# EAGLE design licznik (EAGLE 6.6.0)
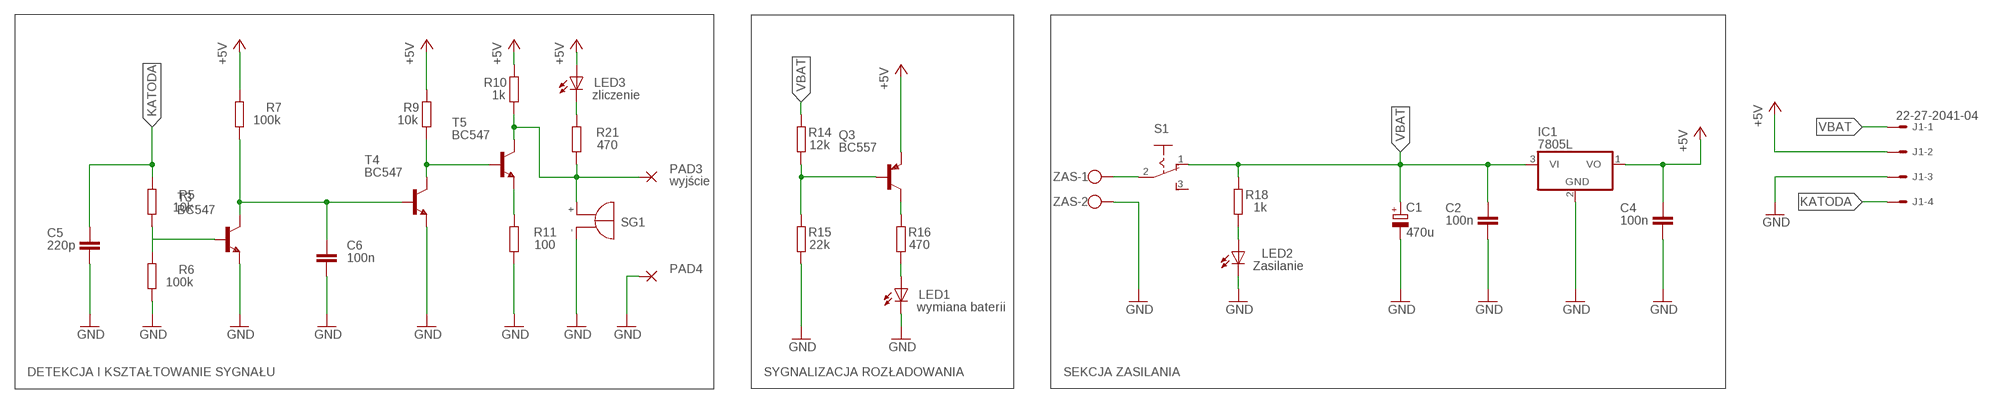
[diagram p0: schematic, sheet 1]

## Parts
C1  470u  CPOL-EUE3.5-8  [E3,5-8]
C2  100n  C5/3  [C5B3]
C4  100n  C5/3  [C5B3]
C5  220p  C5/3  [C5B3]
C6  100n  C5/3  [C5B3]
IC1  7805L  [TO92]
J1  22-27-2041-04  [6410-04]
LED1  wymiana baterii  LED3MM  [LED3MM]
LED2  Zasilanie  LED3MM  [LED3MM]
LED3  zliczenie  LED3MM  [LED3MM]
PAD3  wyjście  WIREPAD2,15/1,0  [2,15/1,0]
PAD4  WIREPAD2,15/1,0  [2,15/1,0]
Q3  BC557  [TO92]
R5  10k  R-EU_0207/10  [0207/10]
R6  100k  R-EU_0207/10  [0207/10]
R7  100k  R-EU_0207/10  [0207/10]
R9  10k  R-EU_0207/10  [0207/10]
R10  1k  R-EU_0207/10  [0207/10]
R11  100  R-EU_0207/10  [0207/10]
R14  12k  R-EU_0207/10  [0207/10]
R15  22k  R-EU_0207/10  [0207/10]
R16  470  R-EU_0207/10  [0207/10]
R18  1k  R-EU_0207/10  [0207/10]
R21  470  R-EU_0207/10  [0207/10]
S1  255SB  [255SB]
SG1  F/QMBIII  [F/QMBIII]
T3  BC547  [TO92]
T4  BC547  [TO92]
T5  BC547  [TO92]
ZAS  W237-102  [W237-102]

## Nets
+5V: C4.1 IC1.1(VO) J1.2 LED3.A Q3.1(E) R7.2 R9.2 R10.2
GND: C1.- C2.2 C4.2 C5.2 C6.2 IC1.2(GND) J1.3 LED1.K(C) LED2.K(C) PAD4.1(P) R6.1 R11.1 R15.1 SG1.-(+) T3.1(E) T4.1(E) ZAS.2
KATODA: C5.1 J1.4 R5.2
N$14: LED2.A R18.1
N$15: LED1.A R16.1
N$17: R5.1 R6.2 T3.2(B)
N$18: C6.1 R7.1 T3.3(C) T4.2(B)
N$19: R11.2 T5.1(E)
N$20: S1.2(P) ZAS.1
N$21: R9.1 T4.3(C) T5.2(B)
N$22: Q3.3(C) R16.2
N$23: Q3.2(B) R14.1 R15.2
N$24: LED3.K(C) R21.2
VBAT: C1.+ C2.1 IC1.3(VI) J1.1 R14.2 R18.2 S1.1(O)
WYJSCIE: PAD3.1(P) R10.1 R21.1 SG1.+(-) T5.3(C)
Unconnected: S1.3(S)

## Notes on the sheet
- DETEKCJA I KSZTAŁTOWANIE SYGNAŁU | SYGNALIZACJA ROZŁADOWANIA | SEKCJA ZASILANIA

## Library data of the parts
C1 = resistor:CPOL-EU: POLARIZED CAPACITOR, European symbol
C2 C4-C6 = capacitor-wima:C: CAPACITOR naming: grid - package width
IC1 = linear:78*: Positive VOLTAGE REGULATOR Source: http://cache.national.com/ds/LM/LM78L05.pdf http://www.fairchildsemi.com/ds/LM/LM7805.pdf
J1 = con-molex:22-?-04: CONNECTOR wire to board 2.54 mm (.1 inch) pitch header; OC_FARNELL: unknown; OC_NEWARK: unknown
LED1-LED3 = led:LED: LED OSRAM: - CHIPLED LG R971, LG N971, LY N971, LG Q971, LY Q971, LO R971, LY R971 LH N974, LH R974 LS Q976, LO Q976, LY Q976 LO Q996 - Hyper CHIPLED LW Q18S LB Q993, LB Q99A, LB R99A - SideLED LS A670, LO A670, LY A670, LG A670, LP A670 LB A673, LV A673, LT A673, LW A673 LH A674 LY A675 LS A676, LA A676, LO A676, LY A676, LW A676 LS A679, LY A679, LG A679 - Hyper Micro SIDELED® LS Y876, LA Y876, LO Y876, LY Y876 LT Y87S - SmartLED LW L88C, LW L88S LB L89C, LB L89S, LG L890 LS L89K, LO L89K, LY L89K LS L896, LA L896, LO L896, LY L896 - TOPLED LS T670, LO T670, LY T670, LG T670, LP T670 LSG T670, LSP T670, LSY T670, LOP T670, LYG T670 LG T671, LOG T671, LSG T671 LB T673, LV T673, LT T673, LW T673 LH T674 LS T676, LA T676, LO T676, LY T676, LB T676, LH T676, LSB T676, LW T676 LB T67C, LV T67C, LT T67C, LS T67K, LO T67K, LY T67K, LW E67C LS E67B, LA E67B, LO E67B, LY E67B, LB E67C, LV E67C, LT E67C LW T67C LS T679, LY T679, LG T679 LS T770, LO T770, LY T770, LG T770, LP T770 LB T773, LV T773, LT T773, LW T773 LH T774 LS E675, LA E675, LY E675, LS T675 LS T776, LA T776, LO T776, LY T776, LB T776 LHGB T686 LT T68C, LB T68C - Hyper Mini TOPLED® LB M676 - Mini TOPLED Santana® LG M470 LS M47K, LO M47K, LY M47K Source: http://www.osram.convergy.de LUXEON: - LUMILED® LXK2-PW12-R00, LXK2-PW12-S00, LXK2-PW14-U00, LXK2-PW14-V00 LXK2-PM12-R00, LXK2-PM12-S00, LXK2-PM14-U00 LXK2-PE12-Q00, LXK2-PE12-R00, LXK2-PE12-S00, LXK2-PE14-T00, LXK2-PE14-U00 LXK2-PB12-K00, LXK2-PB12-L00, LXK2-PB12-M00, LXK2-PB14-N00, LXK2-PB14-P00, LXK2-PB14-Q00 LXK2-PR12-L00, LXK2-PR12-M00, LXK2-PR14-Q00, LXK2-PR14-R00 LXK2-PD12-Q00, LXK2-PD12-R00, LXK2-PD12-S00 LXK2-PH12-R00, LXK2-PH12-S00 LXK2-PL12-P00, LXK2-PL12-Q00, LXK2-PL12-R00 Source: www.luxeon.com KINGBRIGHT: KA-3528ASYC Source: www.kingbright.com
PAD3 PAD4 = wirepad:WIREPAD: Wire PAD connect wire on PCB
Q3 = transistor-pnp:BC557: PNP Transistor
R5-R7 R9-R11 R14-R16 R18 R21 = resistor:R-EU_: RESISTOR, European symbol
S1 = switch:255SB: SLIDING SWITCH Distributor Buerklin, 11G810
SG1 = buzzer:F/QMBIII: BUZZER Source: Buerklin; OC_FARNELL: unknown; OC_NEWARK: unknown
T3-T5 = transistor:BC547: NPN TRANSISTOR
ZAS = con-wago-500:W237-102: WAGO SCREW CLAMP; MPN: 237-102; OC_FARNELL: unknown; OC_NEWARK: 70K9898

## Board
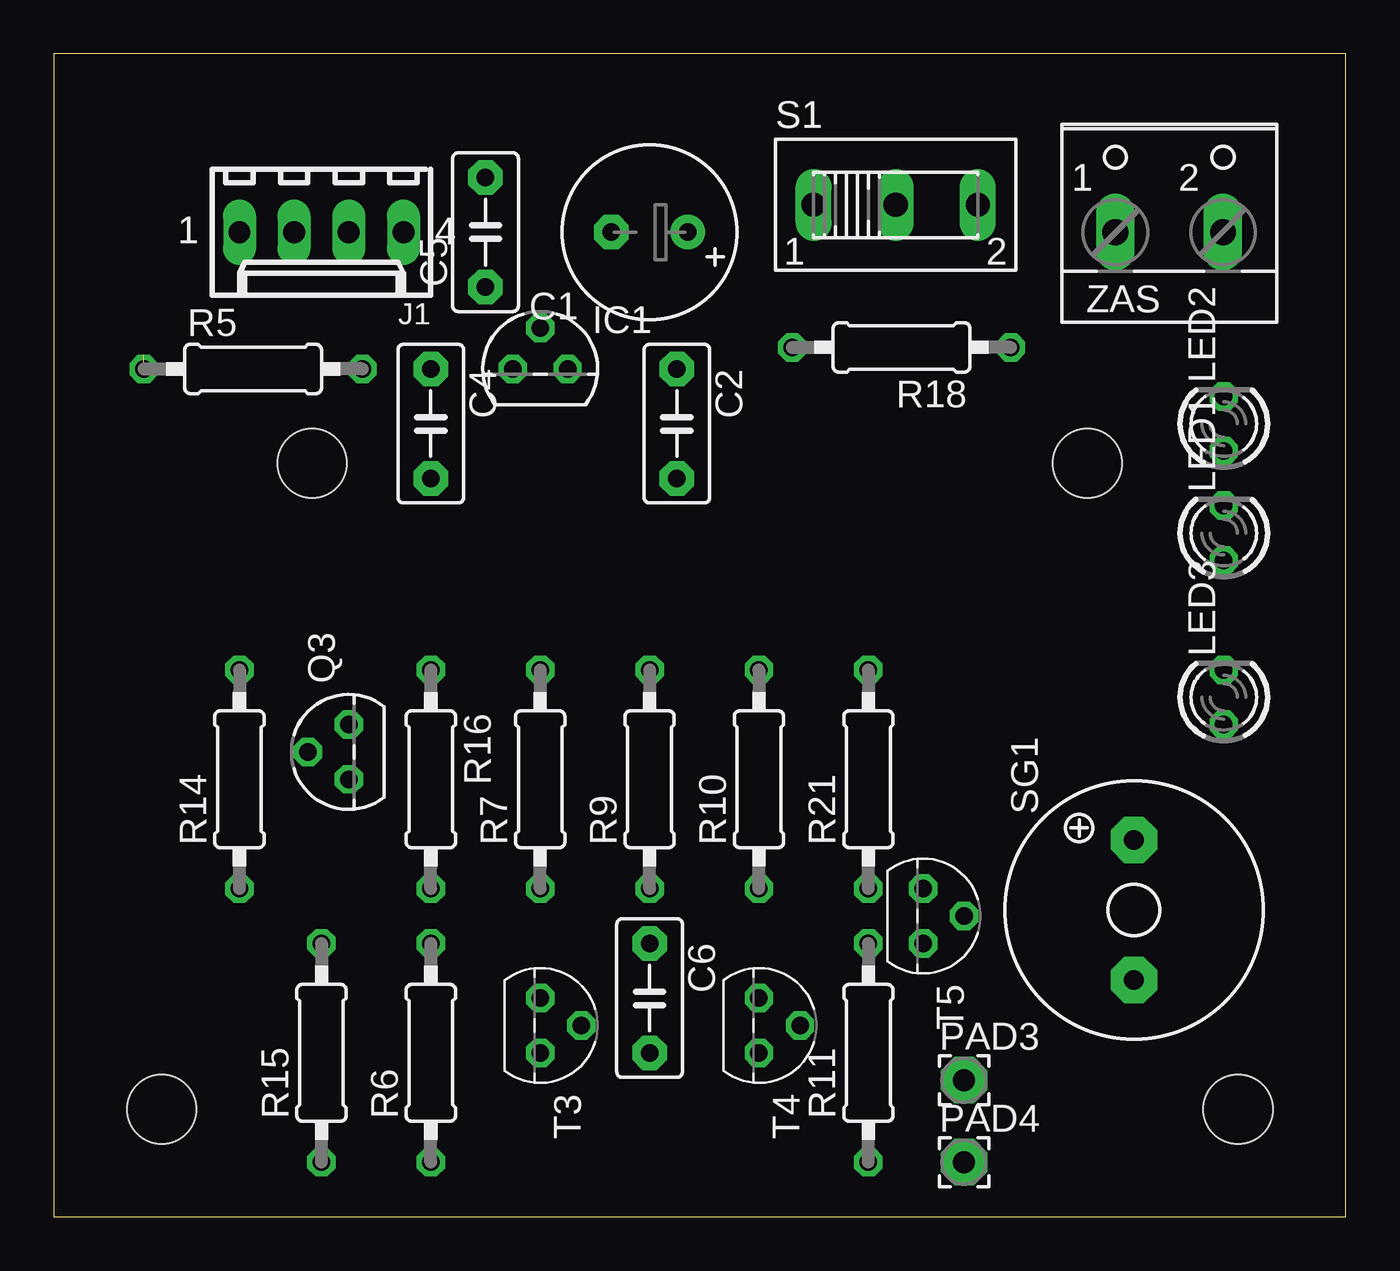
[diagram p1: board, top side]
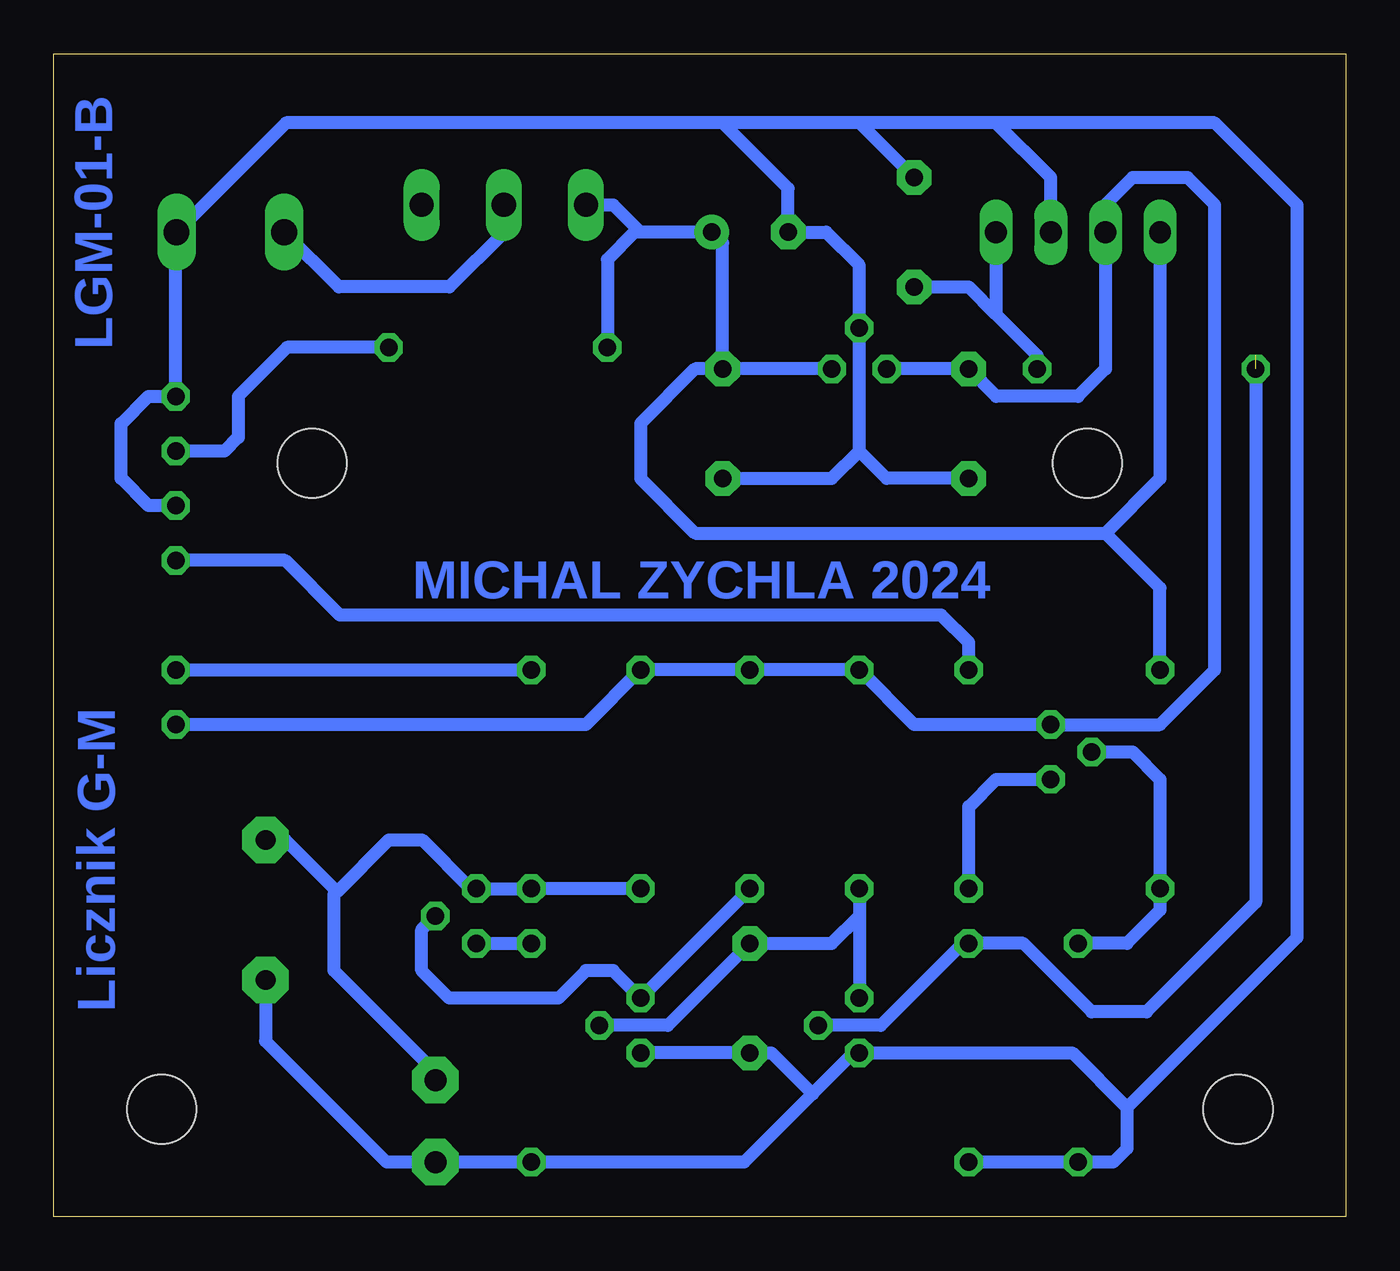
[diagram p2: board, bottom side, seen from below]

Size 60 x 54 mm. Coordinates in mm from the lower left corner, seen from the top.
Outline: 0,0 60,0 60,54 0,54 0,0
Copper layers (1*16): Top 0.035mm / dielectric 1.5mm / Bottom 0.035mm
Design rules "default": minimum track width 10mil, minimum drill 24mil, track to track 8mil, track to pad 8mil, pad to pad 8mil, via to via 8mil, smd to smd 8mil, copper to edge 40mil, drill to drill 8mil, minimum pad ring 10mil, minimum via ring 8mil, stop-mask expansion 4mil, vias tented up to drill 0mil, thermal gap 10mil
Holes 3.2 mm at 5,5 12,35 55,5 48,35

### Footprints (pad centres in the part's own frame; a part is rotated, then mirrored left to right if it is on the bottom)
E3,5-8 = drill 0.813 pad 1.6: + -1.778,0 | drill 0.813 pad 1.6 octagon: - 1.778,0
C5B3 = drill 0.813 pad 1.6 octagon: 1 -2.54,0; 2 2.54,0
TO92 = drill 0.813 octagon: 1 -1.27,0; 2 0,1.905; 3 1.27,0
6410-04 = drill 1.016 long: 1 3.81,0; 2 1.27,0; 3 -1.27,0; 4 -3.81,0
LED3MM = drill 0.813 octagon: A -1.27,0; K 1.27,0
2,15/1,0 = drill 1.016 pad 2.159 octagon: 1 0,0
TO92' = drill 0.813 octagon: 1 1.27,0; 2 0,1.905; 3 -1.27,0
0207/10 = drill 0.813 octagon: 1 -5.08,0; 2 5.08,0
255SB = drill 1.118 long: 1 -3.81,0; 2 0,0; 3 3.81,0
F/QMBIII = drill 0.914 pad 2.159 octagon: + 3.251,0; - -3.251,0
W237-102 = drill 1.194 long: 1 -2.5,-1.27; 2 2.5,-1.27

### Placement (x,y rotation side)
C1  27.67,45.72 180 top
C2  28.94,36.83 270 top
C4  17.51,36.83 270 top
C5  20.05,45.72 90 top
C6  27.67,10.16 270 top
IC1  22.59,39.37 0 top
J1  12.43,45.72 180 top
LED1  54.34,31.75 90 top
LED2  54.34,36.83 90 top
LED3  54.34,24.13 90 top
PAD3  42.27,6.35 0 top
PAD4  42.27,2.54 0 top
Q3  BC557  [TO92']  13.7,21.59 90 top
R5  9.26,39.37 0 top
R6  17.51,7.62 90 top
R7  22.59,20.32 90 top
R9  27.67,20.32 90 top
R10  32.75,20.32 90 top
R11  37.83,7.62 90 top
R14  8.62,20.32 90 top
R15  12.43,7.62 90 top
R16  17.51,20.32 270 top
R18  39.37,40.37 180 top
R21  37.83,20.32 90 top
S1  39.1,46.99 0 top
SG1  50.16,14.26 90 top
T3  BC547  [TO92']  22.59,8.89 270 top
T4  BC547  [TO92']  32.75,8.89 270 top
T5  BC547  [TO92']  40.37,13.97 270 top
ZAS  51.8,46.99 0 top

### Tracks (layer width: path | path; a pad name or v marks a point on that pad's centre or on a via)
+5V
  Bottom 0.61: LED3.A 35.29,22.86 R10.2 R9.2 R7.2 20.05,22.86 Q3.1 8.62,22.86 6.08,25.4 6.08,46.99 7.35,48.26 9.89,48.26 11.16,46.99 J1.2 11.16,39.37 12.43,38.1 16.24,38.1 C4.1 IC1.1
GND
  Bottom 0.61: T4.1 C6.2 26.67,7.62 24.77,5.71 | J1.3 13.7,48.26 16.24,50.8 | 28.94,50.8 25.89,47.75 C1.- 24.13,45.72 22.59,44.18 IC1.2 22.59,35.56 | LED1.K 55.61,33.02 56.88,34.29 56.88,36.83 55.61,38.1 LED2.K 54.34,45.68 ZAS.2 49.22,50.8 28.94,50.8 | C4.2 21.32,34.29 22.59,35.56 | C2.2 23.86,34.29 22.59,35.56 | 16.24,50.8 22.59,50.8 | 22.59,50.8 28.94,50.8 | C5.2 22.59,50.8 | SG1.- 50.16,8.16 44.54,2.54 PAD4.1 R11.1 27.94,2.54 24.77,5.71 | 10.16,5.08 2.27,12.97 2.27,46.99 6.08,50.8 16.24,50.8 | 10.16,5.08 10.16,3.17 10.79,2.54 R15.1 R6.1 | 10.16,5.08 12.7,7.62 T3.1 22.86,7.62 24.77,5.71
KATODA
  Bottom 0.61: J1.4 16.24,41.91 | C5.1 17.51,43.18 16.24,41.91 | R5.2 14.34,40.01 16.24,41.91
N$14
  Bottom 0.61: R18.1 49.16,40.37 51.44,38.1 51.44,36.2 52.07,35.56 LED2.A
N$15
  Bottom 0.61: R16.1 17.51,26.67 18.78,27.94 46.72,27.94 49.26,30.48 LED1.A
N$17  (1 unrouted)
  Bottom 0.61: R5.1 4.17,14.61 9.26,9.53 11.79,9.53 14.97,12.7 R6.2 17.78,12.7 21.59,8.89 T3.2
N$18
  Bottom 0.61: R7.1 22.59,13.97 | 22.59,13.97 T3.3 | T4.2 31.48,8.89 C6.1 23.86,12.7 22.59,13.97
N$19
  Bottom 0.61: T5.1 R11.2
N$20
  Bottom 0.61: S1.2 39.1,45.72 41.64,43.18 46.76,43.18 ZAS.1
N$21
  Bottom 0.61: R9.1 T4.3 34.02,11.43 35.29,11.43 36.56,10.16 41.64,10.16 42.91,11.43 42.91,13.34 T5.2
N$22
  Bottom 0.61: R16.2 17.51,19.05 16.24,20.32 Q3.3
N$23
  Bottom 0.61: Q3.2 9.89,21.59 8.62,20.32 R14.1 8.62,14.24 10.16,12.7 R15.2
N$24
  Bottom 0.61: LED3.K R21.2
VBAT
  Bottom 0.61: IC1.3 C2.1 | C2.1 30.21,39.37 32.75,36.83 32.75,34.29 30.21,31.75 11.16,31.75 | C2.1 28.94,45.21 C1.+ 32.75,45.72 | S1.1 34.02,46.99 32.75,45.72 | J1.1 8.62,34.29 11.16,31.75 | R14.2 8.62,29.21 11.16,31.75 | 32.75,45.72 33.02,45.72 34.29,44.45 R18.2
WYJSCIE
  Bottom 0.61: R10.1 R21.1 T5.3 40.64,15.24 42.91,17.51 44.45,17.51 46.85,15.1 | PAD3.1 42.27,6.71 46.99,11.43 46.99,14.97 46.85,15.1 | SG1.+ 49.26,17.51 46.85,15.1

### Text on the board
Bottom: LGM-01-B | MICHAL ZYCHLA 2024 | Licznik G-M